# Altium project Low_Level_ECU.PrjPcb (part 2 of 6)

## Sheet 04- Sub Power Supply.SchDoc: Power Supply
size 420 x 297 mm; DocumentNumber: 2; Revision: 1.0; SheetNumber: 4; SheetTotal: 13; Project: LOW LEVEL ECU
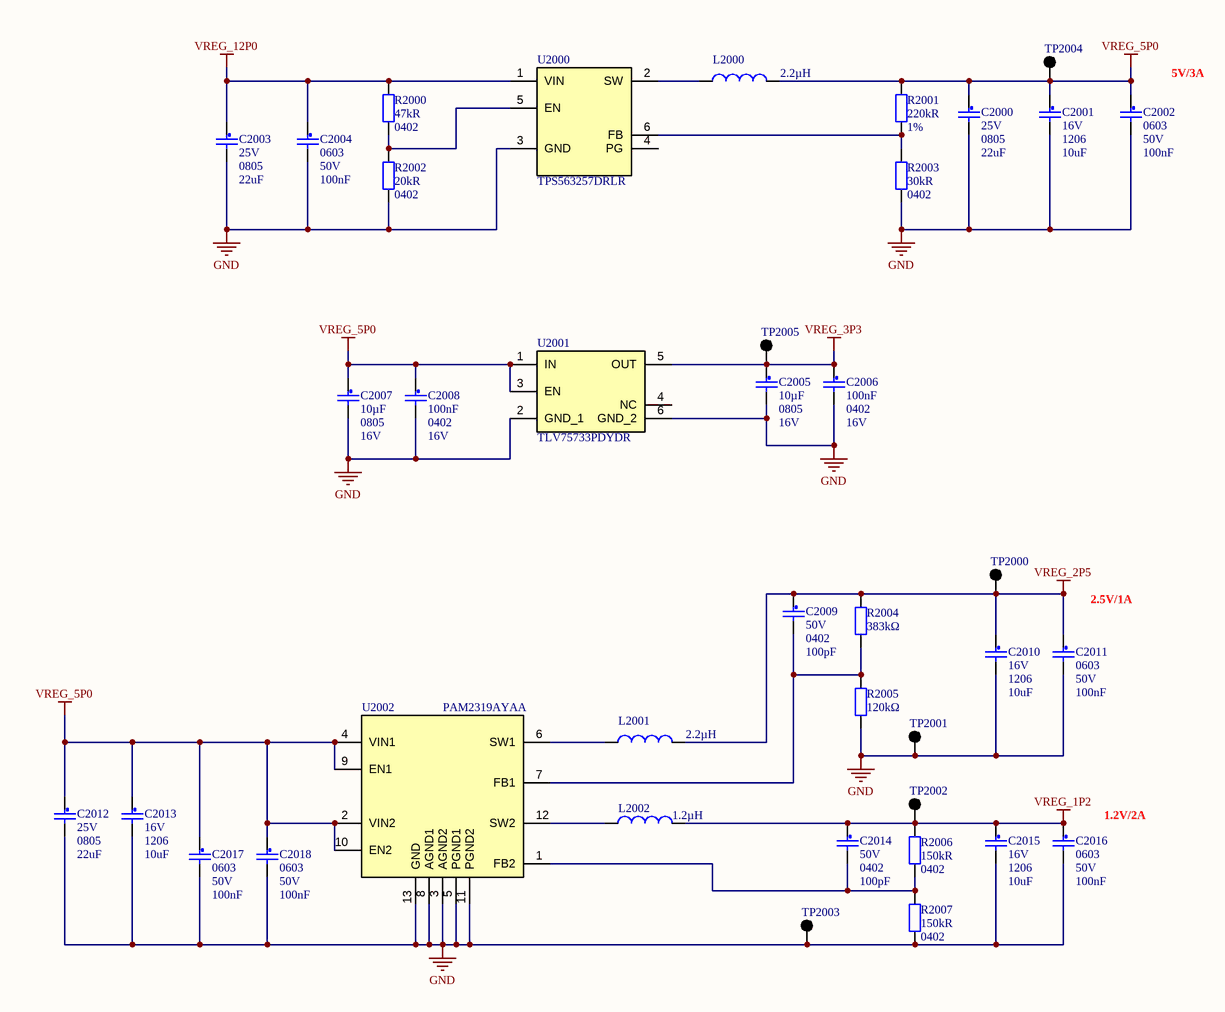
[diagram p2: 04- Sub Power Supply.SchDoc]

### Parts
C2000  Voltage Rating: 25V  Case/Package: 0805  Capacitance: 22uF  [CAP0805]  (hidden comment: GRM21BR61E226ME44K)
C2001  Voltage Rating: 16V  Case/Package: 1206  Capacitance: 10uF  [CAP1206]  (hidden comment: CL31B106KOHVPNE)
C2002  Case/Package: 0603  Voltage Rating: 50V  Capacitance: 100nF  [CAP0603]  (hidden comment: CL10B104KB8WPNC)
C2003  Voltage Rating: 25V  Case/Package: 0805  Capacitance: 22uF  [CAP0805]  (hidden comment: GRM21BR61E226ME44K)
C2004  Case/Package: 0603  Voltage Rating: 50V  Capacitance: 100nF  [CAP0603]  (hidden comment: CL10B104KB8WPNC)
C2005  value 10µF  Case/Package: 0805  Voltage Rating: 16V  [CAP0805]  (hidden comment: GRM21BZ71C106KE15L)
C2006  Capacitance: 100nF  Case/Package: 0402  Voltage Rating (DC): 16V  [CAP0402]  (hidden comment: 0402YC104KAT2A)
C2007  value 10µF  Case/Package: 0805  Voltage Rating: 16V  [CAP0805]  (hidden comment: GRM21BZ71C106KE15L)
C2008  Capacitance: 100nF  Case/Package: 0402  Voltage Rating (DC): 16V  [CAP0402]  (hidden comment: 0402YC104KAT2A)
C2009  Voltage Rating: 50V  Case/Package: 0402  Capacitance: 100pF  [CAP0402]  (hidden comment: GCM1555C1H101JA16D)
C2010  Voltage Rating: 16V  Case/Package: 1206  Capacitance: 10uF  [CAP1206]  (hidden comment: CL31B106KOHVPNE)
C2011  Case/Package: 0603  Voltage Rating: 50V  Capacitance: 100nF  [CAP0603]  (hidden comment: CL10B104KB8WPNC)
C2012  Voltage Rating: 25V  Case/Package: 0805  Capacitance: 22uF  [CAP0805]  (hidden comment: GRM21BR61E226ME44K)
C2013  Voltage Rating: 16V  Case/Package: 1206  Capacitance: 10uF  [CAP1206]  (hidden comment: CL31B106KOHVPNE)
C2014  Voltage Rating: 50V  Case/Package: 0402  Capacitance: 100pF  [CAP0402]  (hidden comment: GCM1555C1H101JA16D)
C2015  Voltage Rating: 16V  Case/Package: 1206  Capacitance: 10uF  [CAP1206]  (hidden comment: CL31B106KOHVPNE)
C2016  Case/Package: 0603  Voltage Rating: 50V  Capacitance: 100nF  [CAP0603]  (hidden comment: CL10B104KB8WPNC)
C2017  Case/Package: 0603  Voltage Rating: 50V  Capacitance: 100nF  [CAP0603]  (hidden comment: CL10B104KB8WPNC)
C2018  Case/Package: 0603  Voltage Rating: 50V  Capacitance: 100nF  [CAP0603]  (hidden comment: CL10B104KB8WPNC)
L2000  value 2.2µH  [INDP414121]  (hidden comment: 74438356022)
L2001  value 2.2µH  [INDP414121]  (hidden comment: 74438356022)
L2002  value 1.2µH  [INDP414121]  (hidden comment: 74438356012)
R2000  Resistance: 47kR  Case/Package: 0402  [RES0402]  (hidden comment: AC0402JR-0747KL)
R2001  value 220kR  Tolerance: 1%  [RES0603]  (hidden comment: RMCF0603FT220K)
R2002  Resistance: 20kR  Case/Package: 0402  [RES0402]  (hidden comment: RC0402FR-0720KL)
R2003  Resistance: 30kR  Case/Package: 0402  [RES0402]  (hidden comment: RMCF0402FT30K0)
R2004  value 383kΩ  [RES0402]  (hidden comment: RC0402FR-07383KL)
R2005  value 120kΩ  [RES0402]  (hidden comment: RT0402FRE07120KL)
R2006  Resistance: 150kR  Case/Package: 0402  [RES0402]  (hidden comment: RC0402FR-07150KL)
R2007  Resistance: 150kR  Case/Package: 0402  [RES0402]  (hidden comment: RC0402FR-07150KL)
TP2000  TP  [TP-SMD-R1]  (value not drawn)  (no BOM)
TP2001  TP  [TP-SMD-R1]  (value not drawn)  (no BOM)
TP2002  TP  [TP-SMD-R1]  (value not drawn)  (no BOM)
TP2003  TP  [TP-SMD-R1]  (value not drawn)  (no BOM)
TP2004  TP  [TP-SMD-R1]  (value not drawn)  (no BOM)
TP2005  TP  [TP-SMD-R1]  (value not drawn)  (no BOM)
U2000  TPS563257DRLR  [SOT-563]
U2001  TLV75733PDYDR  [SOT-23-5 with EPAD]
U2002  PAM2319AYAA  [12-WFDFN_Exposed Pad]

### Nets
GND: C2000.2 C2001.2 C2002.2 C2003.2 C2004.2 C2005.2 C2006.2 C2007.2 C2008.2 C2010.2 C2011.2 C2012.2 C2013.2 C2015.2 C2016.2 C2017.2 C2018.2 R2002.1 R2003.1 R2005.1 R2007.1 TP2001.1 TP2003.1 U2000.3(GND) U2001.2(GND_1) U2001.6(GND_2) U2002.3(AGND2) U2002.5(PGND1) U2002.8(AGND1) U2002.11(PGND2) U2002.13(GND)
VREG_1P2: C2014.1 C2015.1 C2016.1 L2002.2 R2006.2 TP2002.1
VREG_2P5: C2009.1 C2010.1 C2011.1 L2001.2 R2004.2 TP2000.1
VREG_3P3: C2005.1 C2006.1 TP2005.1 U2001.5(OUT)
VREG_5P0: C2000.1 C2001.1 C2002.1 C2007.1 C2008.1 C2012.1 C2013.1 C2017.1 C2018.1 L2000.2 R2001.1 TP2004.1 U2001.1(IN) U2001.3(EN) U2002.2(VIN2) U2002.4(VIN1) U2002.9(EN1) U2002.10(EN2)
VREG_12P0: C2003.1 C2004.1 R2000.2 U2000.1(VIN)
NetC2009_2: C2009.2 R2004.1 R2005.2 U2002.7(FB1)
NetC2014_2: C2014.2 R2006.1 R2007.2 U2002.1(FB2)
NetL2000_1: L2000.1 U2000.2(SW)
NetL2001_1: L2001.1 U2002.6(SW1)
NetL2002_1: L2002.1 U2002.12(SW2)
NetR2000_1: R2000.1 R2002.2 U2000.5(EN)
NetR2001_2: R2001.2 R2003.2 U2000.6(FB)

Not connected (* = marked no-connect by the designer): U2000 4(PG); U2001 4(NC)

### Notes on the sheet
- (near C2002) 5V/3A
- (near C2011) 2.5V/1A
- (near C2016) 1.2V/2A
- TITLE:
- PROJECT:
- Design by:
- Check by:
- Approve by:
- DRAWING NUMBER:
- REVISION:
- SIZE: A3
- SHEET NUMBER
- OFF
- DATE:

### Library data of the parts
C2000 C2003 C2012 = CMP-ROOT-0068-6: CAP CER 22uF 25V 20% X5R 0805 SMD; Manufacturer 1: Murata Electronics; Crossable(YES/NO): YES; Height: 1.25mm; Length: 0.079inch; Max Operating Temperature: 85°C; Tolerance: 20%; Mount Type(SMD/TH): SMD; Manufacturer Part Number 1: GRM21BR61E226ME44K; Weight: 0.000335oz; Dielectric: X5R; Packaging: Tape and Reel; Package Quantity: 10000; Mount: Surface Mount; Termination: SMD/SMT; Composition: Ceramic; Case Code (Imperial): 0805; Thickness: 0.057inch; Voltage Rating (DC): 25V; Case Code (Metric): 2012; Width: 1.25mm; Min Operating Temperature: -55°C; Lead Free: Lead Free
C2001 C2010 C2013 C2015 = CMP-00045-5: CAP CER 10uF 16V 10% X7R 1206 SMD; Manufacturer 1: Samsung; Crossable(YES/NO): YES; Ratings: AEC-Q200; Packaging: Tape and Reel; Thickness: 0.071inch; Min Operating Temperature: -55°C; Case Code (Metric): 3216; Max Operating Temperature: 125°C; Mount: Surface Mount; Length: 0.126inch; Dielectric: X7R; Tolerance: 10%; Width: 0.063inch; Case Code (Imperial): 1206; Manufacturer Part Number 1: CL31B106KOHVPNE; Features: Soft Termination; Mount Type(SMD/TH): SMD; Height: 1.6mm; Lead Free: Lead Free; Voltage Rating (DC): 16V
C2002 C2004 C2011 C2016-C2018 = CMP-00005-5: CAP CER 0.1UF 50V X7R 0603; Manufacturer 1: Samsung; Mount Type(SMD/TH): SMD; Crossable(YES/NO): YES; Tolerance: 10%; Length: 0.063inch; Mount: Surface Mount; Thickness: 0.035inch; Max Operating Temperature: 125°C; Lead Free: Lead Free; Ratings: AEC-Q200; Min Operating Temperature: -55°C; Case Code (Metric): 1608; Features: Soft Termination; Case Code (Imperial): 0603; Width: 0.031inch; Manufacturer Part Number 1: CL10B104KB8WPNC; Packaging: Tape and Reel; Height: 0.8mm; Voltage Rating (DC): 50V
C2005 C2007 = CMP-01170-1: CAP CER 10UF 16V X7R 0805; Manufacturer: Murata; Manufacturer Lifecycle Status: IN PRODUCTION; Dielectric Material: Ceramic; Tolerance: 10%; Length: 2mm; Category: Ceramic Capacitors; Height: 1.25mm; Lifecycle Status: Production; Manufacturer Part Number: GRM21BZ71C106KE15L; Material: Ceramic; Max Operating Temperature: 125°C; Min Operating Temperature: -55°C; Mounting Technology: Surface Mount; Number of Terminals: 2; REACH SVHC: Yes; RoHS: Compliant; Thickness: 1.25mm; Voltage Rating (DC): 16V; Width: 1.25mm
C2006 C2008 = CMP-00988-1: as C1025 on sheet 03- Power Supply; Case Code (Imperial): 0402; Case Code (Metric): 1005; Dielectric: X7R; Manufacturer Part Number 1: 0402YC104KAT2A; Max Operating Temperature: 125°C; Min Operating Temperature: -55°C; Mount: Surface Mount; Voltage Rating: 16V
C2009 C2014 = CMP-00107-4: CAP CER 100pF 50V 5% C0G 0402 SMD; Manufacturer 1: Murata Electronics; Crossable(YES/NO): YES; Depth: 0.5mm; Thickness: 0.022inch; Voltage: 50V; Max Operating Temperature: 125°C; Dielectric: C0G; Radiation Hardening: No; Case Code (Metric): 1005; Weight: 0.000212oz; Manufacturer Part Number 1: GCM1555C1H101JA16D; Package Quantity: 10000; Termination: SMD/SMT; Tolerance: 5%; Voltage Rating (DC): 50V; Mount: Surface Mount; Min Operating Temperature: -55°C; Mount Type(SMD/TH): SMD; Height: 0.5mm; Case Code (Imperial): 0402; Width: 0.02inch; Packaging: Tape and Reel; Lead Free: Lead Free; REACH SVHC: No SVHC; Length: 1mm; Ratings: AEC-Q200
L2000 L2001 = CMP-01184-1: FIXED IND 2.2UH 4.7A 35 MOHM SMD; Manufacturer: Wurth Elektronik; Core Material: Composite, Metal; DC Resistance (DCR): 29mΩ; Inductance Tolerance: 20%; Saturation Current: 6.2A; Self Resonant Frequency: 34MHz; Shielding: Shielded; Test Frequency: 100kHz; Case/Package: SMD/SMT; Ambient Temperature Range High: 85°C; Ambient Temperature Range Low: -40°C; Category: Fixed Inductors; Current Rating: 4.7A; Height: 2mm; Height - Seated (Max): 2.1082mm; Length: 4mm; Manufacturer Part Number: 74438356022; Max Operating Temperature: 125°C; Min Operating Temperature: -40°C; Mounting Technology: Surface Mount; Pins: 2; REACH SVHC: Unknown; RMS Current (Irms): 4.7A; RoHS: Compliant; Tolerance: 20%; Width: 4mm
L2002 = CMP-01185-1: FIXED IND 1.2UH 5.8A 18 MOHM SMD; Manufacturer: Wurth Elektronik; Core Material: Composite, Metal; DC Resistance (DCR): 15mΩ; Inductance Tolerance: 20%; Saturation Current: 9A; Self Resonant Frequency: 52MHz; ESR: 18mΩ; Shielding: Shielded; Test Frequency: 100kHz; Ambient Temperature Range High: 85°C; Ambient Temperature Range Low: -40°C; Case/Package: SMD/SMT; Category: Fixed Inductors; Current Rating: 5.8A; Height: 2mm; Height - Seated (Max): 2.1082mm; Length: 4mm; Manufacturer Part Number: 74438356012; Max Operating Temperature: 125°C; Min Operating Temperature: -40°C; Mounting Technology: Surface Mount; Pins: 2; REACH SVHC: Unknown; RMS Current (Irms): 5.8A; RoHS: Compliant; Tolerance: 20%; Width: 4mm
R2000 = CMP-00109-2: RES SMD 47K OHM 5% 1/16W 0402; Manufacturer 1: Yageo; Power Rating: 62.5mW; Voltage Rating: 50V; Max Power Dissipation: 63mW; Temperature Coefficient: 100ppm/°C; Crossable(YES/NO): YES; Height: 0.015inch; Mount Type(SMD/TH): SMD; Features: Moisture Resistant,Automotive AEC-Q200; Min Operating Temperature: -55°C; Number of Terminations: 2; Case Code (Metric): 1005; Packaging: Tape and Reel; Width: 0.02inch; Manufacturer Part Number 1: AC0402JR-0747KL; Tolerance: 5%; Termination: SMD/SMT; Lead Free: Lead Free; Case Code (Imperial): 0402; Length: 0.039inch; Composition: Thick Film; Max Operating Temperature: 155°C
R2001 = CMP-01087-1: RES 220K OHM 1% 1/10W 0603; Manufacturer: Stackpole Electronics; Package Width: 0.8mm; Package Height: 0.45mm; Package Length: 1.55mm; Power: 100mW; Rated Temperature: 70°C; Reference Standard: AEC-Q200; Temperature Coefficient (ppm/Cel): 100; Working Voltage: 75V; Category: Chip SMD Resistors; Construction: Rectangular; JESD-609 Code: e3; Manufacturer Part Number: RMCF0603FT220K; Max Operating Temperature: 155°C; Min Operating Temperature: -55°C; Mounting Technology: Surface Mount; Pins: 2; Package Shape: Rectangular; Packaging: Tape and Reel; Reach SVHC Compliant: Yes; Resistor Type: FIXED RESISTOR; RoHS Compliant: Yes; Case/Package: 0603; Technology: METAL GLAZE/THICK FILM; Terminal Finish: Nickel; Termination: Wraparound
R2002 = CMP-00464-1: RES SMD 20K OHM 1% 1/16W 0402; Manufacturer 1: Yageo; Power Rating: 62.5mW; Crossable(YES/NO): YES; Max Power Dissipation: 63mW; Temperature Coefficient: 100ppm/°C; Voltage Rating: 50V; REACH SVHC: No SVHC; Length: 1mm; Termination: SMD/SMT; Mount Type(SMD/TH): SMD; Number of Pins: 2; Lead Free: Lead Free; Number of Terminations: 2; Width: 0.02inch; Composition: Thick Film; Manufacturer Part Number 1: RC0402FR-0720KL; Features: Moisture Resistant; Min Operating Temperature: -55°C; Max Operating Temperature: 155°C; Packaging: Tape and Reel; Depth: 0.5mm; Case Code (Imperial): 0402; Height: 0.016inch; Voltage Rating (DC): 50V; Case Code (Metric): 1005; Military Standard: Not; Package Quantity: 1; Tolerance: 1%
R2003 = CMP-00355-2: RES 30kR 1/16W 1% 0402 SMD; Manufacturer 1: Stackpole Electronics Inc; Max Power Dissipation: 63mW; Crossable(YES/NO): YES; Temperature Coefficient: 100ppm/°C; Case Code (Metric): 1005; Case Code (Imperial): 0402; Tolerance: 1%; Contact Plating: Tin,Matte; Features: Automotive AEC-Q200; Number of Terminations: 2; Length: 0.039inch; Packaging: Tape and Reel; Max Operating Temperature: 155°C; Mount Type(SMD/TH): SMD; Min Operating Temperature: -55°C; Mount: Surface Mount; Height: 0.016inch; Radiation Hardening: No; Composition: Thick Film; Manufacturer Part Number 1: RMCF0402FT30K0; Width: 0.02inch; Package Quantity: 10000
R2004 = CMP-01187-1: RES 383K OHM 1% 1/16W 0402; Manufacturer: Yageo Group; Max Power Dissipation: 63mW; Power Dissipation: 62.5mW; Temperature Coefficient: 100ppm/°C; Voltage Rating: 50V; China RoHS: Non-Compliant; Case Code (Imperial): 0402; Case Code (Metric): 1005; Case/Package: 0402; Category: Chip SMD Resistors; Composition: Thick Film; Contact Plating: Tin; Depth: 500µm; Features: Moisture Resistant; Height: 350µm; Lead Free: Lead Free; Length: 1mm; Lifecycle Status: Production; Manufacturer Part Number: RC0402FR-07383KL; Max Operating Temperature: 155°C; Military Standard: Not; Min Operating Temperature: -55°C; Mounting Technology: Surface Mount; Number of Terminals: 2; Number of Terminations: 2; Power Rating: 63mW; Radiation Hardening: No; REACH SVHC: Yes; RoHS: Compliant; Schedule B: 8533210045, 8533210045|8533210045|8533210045|8533210045|8533210045; Termination: SMD/SMT; Tolerance: 1%; Voltage Rating (DC): 50V; Width: 500µm; Working Voltage: 50V
R2005 = CMP-01186-1: RES SMD 120K OHM 1% 1/16W 0402; Manufacturer: Yageo Group; Power Dissipation: 62.5mW; Power Rating: 63mW; Temperature Coefficient: 50ppm/°C; Voltage Rating: 50V; China RoHS: Non-Compliant; Case Code (Metric): 0402; Case/Package: 0402; Category: Chip SMD Resistors; Composition: Thin Film; Contact Plating: Tin; Depth: 500µm; Height: 300µm; Lead Free: Lead Free; Length: 1mm; Lifecycle Status: Production; Manufacturer Part Number: RT0402FRE07120KL; Max Operating Temperature: 155°C; Military Standard: Not; Min Operating Temperature: -55°C; Mounting Technology: Surface Mount; Number of Terminals: 2; Radiation Hardening: No; REACH SVHC: Yes; RoHS: Compliant; Tolerance: 1%; Voltage Rating (DC): 50V; Width: 500µm; Working Voltage: 50V
R2006 R2007 = CMP-00368-1: RES SMD 150K OHM 1% 1/16W 0402; Manufacturer 1: Yageo; Voltage Rating (DC): 50V; Power Rating: 62.5mW; Crossable(YES/NO): YES; Temperature Coefficient: 100ppm/°C; Max Power Dissipation: 63mW; Tolerance: 1%; Termination: SMD/SMT; Number of Pins: 2; Features: Moisture Resistant; Min Operating Temperature: -55°C; REACH SVHC: No SVHC; Military Standard: Not; Packaging: Tape and Reel; Composition: Thick Film; Mount Type(SMD/TH): SMD; Package Quantity: 1; Height: 0.016inch; Case Code (Imperial): 0402; Manufacturer Part Number 1: RC0402FR-07150KL; Depth: 0.5mm; Lead Free: Lead Free; Case Code (Metric): 1005; Width: 0.5mm; Voltage Rating: 50V; Working Voltage: 50V; Length: 1mm; Max Operating Temperature: 155°C; Number of Terminations: 2
TP2000-TP2005 = CMP-ROOT-0080-12: Test Point 1x1mm; Manufacturer Part Number 1: NA; Mount Type(SMD/TH): TH; Crossable(YES/NO): YES; Manufacturer 1: N/A
U2000 = CMP-01183-1: IC REG BUCK ADJ 3A SOT563; Manufacturer: Texas Instruments; Manufacturer Lifecycle Status: ACTIVE; Category: Voltage Regulators - Switching; Height: 600µm; Length: 1.6mm; Lifecycle Status: Production; Manufacturer Part Number: TPS563257DRLR; Pins: 6; RoHS: Compliant; Thickness: 550µm; Topology: Buck; Width: 1.2mm
U2001 = CMP-01189-1: IC REG LINEAR 3.3V 1A SOT23-5; Manufacturer: Texas Instruments; Manufacturer Lifecycle Status: ACTIVE; Dropout Voltage: 1.35V; Accuracy: 1%; Max Junction Temperature (Tj): 125°C; Max Supply Voltage: 5.5V; Min Supply Voltage: 1.45V; Number of Outputs: 1; Case/Package: SOT-23; Category: LDO Voltage Regulators; Height: 1.45mm; Length: 2.9mm; Lifecycle Status: Production; Manufacturer Part Number: TLV75733PDYDR; Max Operating Temperature: 125°C; Min Operating Temperature: -40°C; Pins: 5; Output Current: 1A; Output Voltage: 3.3V; RoHS: Compliant; Schedule B: 8542390000, 8542390000|8542390000|8542390000|8542390000|8542390000; Thickness: 1.2mm; Width: 1.6mm
U2002 = CMP-01159-1: IC REG BUCK ADJ 1A/2A DL 12WDFN; Manufacturer: Diodes Inc.; Efficiency: 87%; Max Supply Voltage: 5.5V; Max Output current: 2A; Max Output Voltage: 3.3V; Min Input Voltage: 2.7V; Min Output Voltage: 1V; Number of Outputs: 2; Output Configuration: Positive; Output Type: Adjustable; Switching Frequency: 2.5MHz; Synchronous Rectifier: Yes; Category: Voltage Regulators - Switching; China RoHS: Compliant; Color: Black; Diameter: 20.193mm; Height: 14.986mm; Lead Free: Lead Free; Lifecycle Status: Production; Manufacturer Part Number: PAM2319AYAA; Material: Plastic; Max Operating Temperature: 85°C; Min Operating Temperature: -40°C; Mounting Technology: Surface Mount; Pins: 12; Operating Supply Voltage: 5.5V; Output Current: 2A; Output Voltage: 3.3V; Packaging: Tape & Reel; Radiation Hardening: No; REACH SVHC: Yes; RoHS: Compliant; Schedule B: 8542390000, 8542390000|8542390000|8542390000|8542390000|8542390000

## Sheet 05- MCU POWER.SchDoc: MCU1
size 420 x 297 mm; Revision: 1.0; SheetNumber: 5; SheetTotal: 13; Project: LOW LEVEL ECU
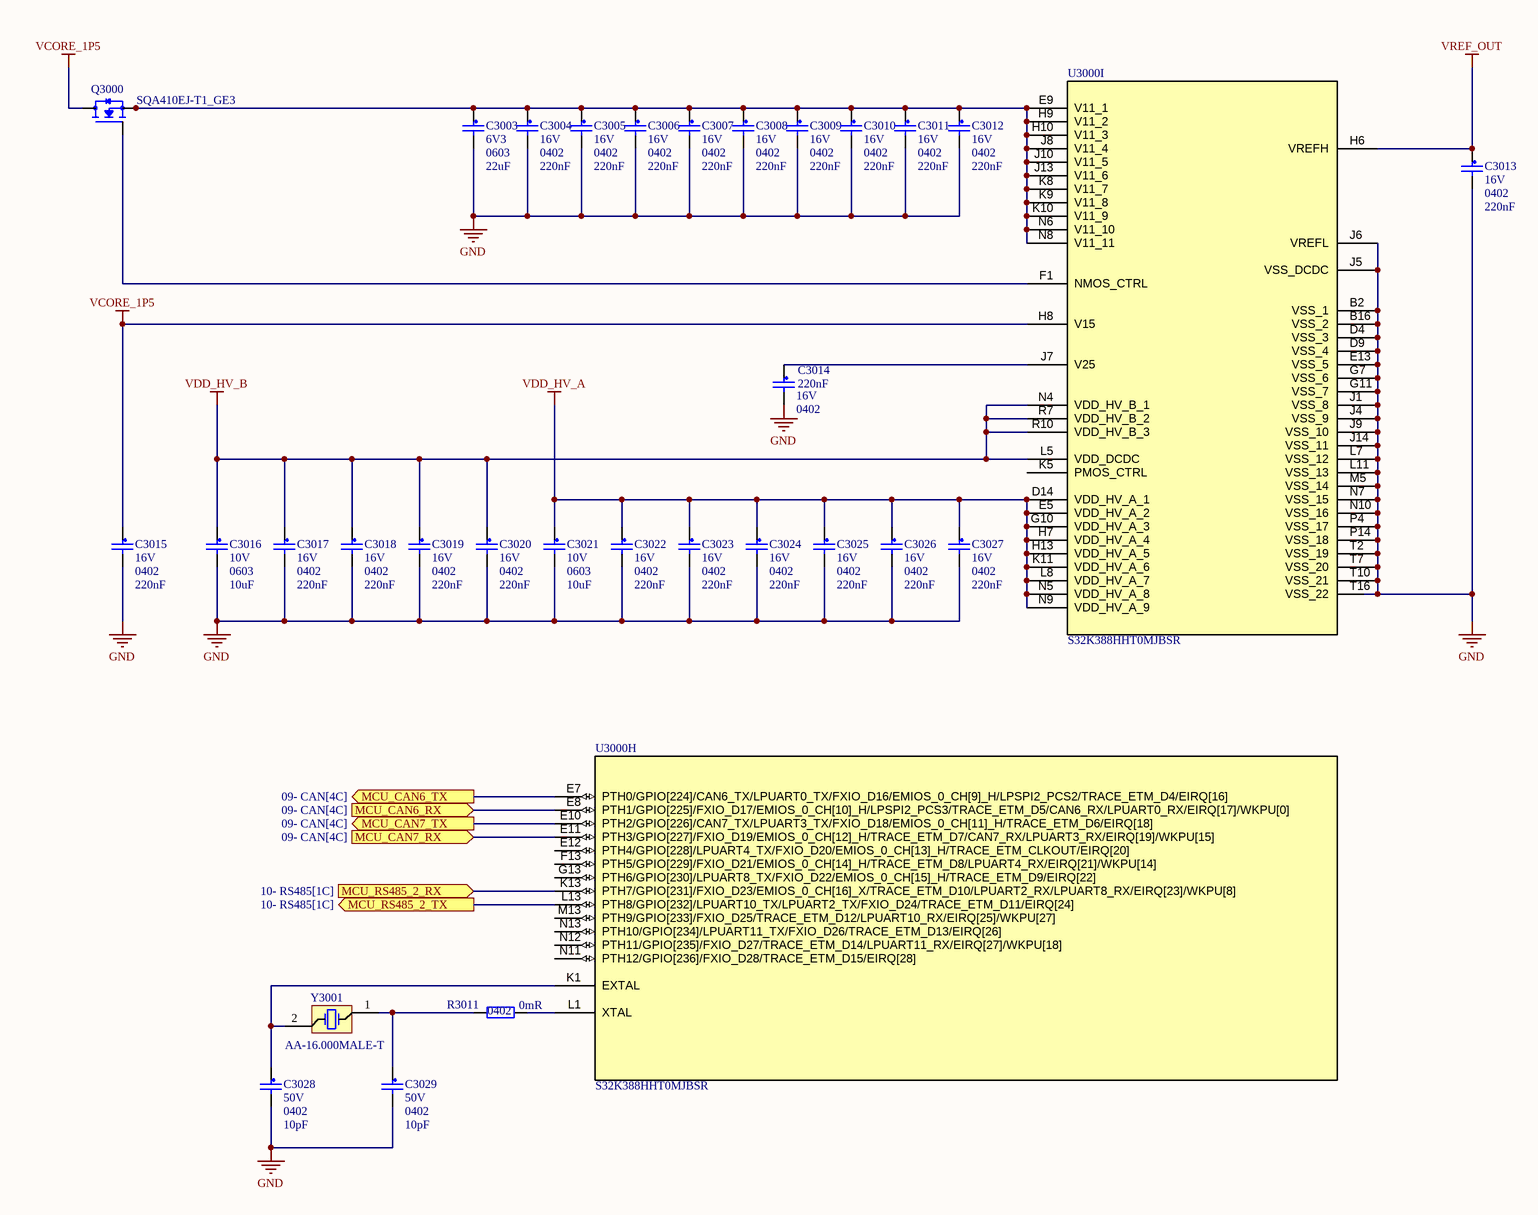
[diagram p3: 05- MCU POWER.SchDoc]

### Parts
C3003  Voltage Rating: 6V3  Case/Package: 0603  Capacitance: 22uF  [CAP0603]  (hidden comment: GRT188C80J226ME13D)
C3004  Voltage Rating: 16V  Case/Package: 0402  Capacitance: 220nF  [CAP0402]  (hidden comment: GCM155R71C224KE02D)
C3005  Voltage Rating: 16V  Case/Package: 0402  Capacitance: 220nF  [CAP0402]  (hidden comment: GCM155R71C224KE02D)
C3006  Voltage Rating: 16V  Case/Package: 0402  Capacitance: 220nF  [CAP0402]  (hidden comment: GCM155R71C224KE02D)
C3007  Voltage Rating: 16V  Case/Package: 0402  Capacitance: 220nF  [CAP0402]  (hidden comment: GCM155R71C224KE02D)
C3008  Voltage Rating: 16V  Case/Package: 0402  Capacitance: 220nF  [CAP0402]  (hidden comment: GCM155R71C224KE02D)
C3009  Voltage Rating: 16V  Case/Package: 0402  Capacitance: 220nF  [CAP0402]  (hidden comment: GCM155R71C224KE02D)
C3010  Voltage Rating: 16V  Case/Package: 0402  Capacitance: 220nF  [CAP0402]  (hidden comment: GCM155R71C224KE02D)
C3011  Voltage Rating: 16V  Case/Package: 0402  Capacitance: 220nF  [CAP0402]  (hidden comment: GCM155R71C224KE02D)
C3012  Voltage Rating: 16V  Case/Package: 0402  Capacitance: 220nF  [CAP0402]  (hidden comment: GCM155R71C224KE02D)
C3013  Voltage Rating: 16V  Case/Package: 0402  Capacitance: 220nF  [CAP0402]  (hidden comment: GCM155R71C224KE02D)
C3014  Voltage Rating: 16V  Case/Package: 0402  Capacitance: 220nF  [CAP0402]  (hidden comment: GCM155R71C224KE02D)
C3015  Voltage Rating: 16V  Case/Package: 0402  Capacitance: 220nF  [CAP0402]  (hidden comment: GCM155R71C224KE02D)
C3016  Voltage Rating: 10V  Case/Package: 0603  Capacitance: 10uF  [CAP0603]  (hidden comment: CL10A106MP8NNNC)
C3017  Voltage Rating: 16V  Case/Package: 0402  Capacitance: 220nF  [CAP0402]  (hidden comment: GCM155R71C224KE02D)
C3018  Voltage Rating: 16V  Case/Package: 0402  Capacitance: 220nF  [CAP0402]  (hidden comment: GCM155R71C224KE02D)
C3019  Voltage Rating: 16V  Case/Package: 0402  Capacitance: 220nF  [CAP0402]  (hidden comment: GCM155R71C224KE02D)
C3020  Voltage Rating: 16V  Case/Package: 0402  Capacitance: 220nF  [CAP0402]  (hidden comment: GCM155R71C224KE02D)
C3021  Voltage Rating: 10V  Case/Package: 0603  Capacitance: 10uF  [CAP0603]  (hidden comment: CL10A106MP8NNNC)
C3022  Voltage Rating: 16V  Case/Package: 0402  Capacitance: 220nF  [CAP0402]  (hidden comment: GCM155R71C224KE02D)
C3023  Voltage Rating: 16V  Case/Package: 0402  Capacitance: 220nF  [CAP0402]  (hidden comment: GCM155R71C224KE02D)
C3024  Voltage Rating: 16V  Case/Package: 0402  Capacitance: 220nF  [CAP0402]  (hidden comment: GCM155R71C224KE02D)
C3025  Voltage Rating: 16V  Case/Package: 0402  Capacitance: 220nF  [CAP0402]  (hidden comment: GCM155R71C224KE02D)
C3026  Voltage Rating: 16V  Case/Package: 0402  Capacitance: 220nF  [CAP0402]  (hidden comment: GCM155R71C224KE02D)
C3027  Voltage Rating: 16V  Case/Package: 0402  Capacitance: 220nF  [CAP0402]  (hidden comment: GCM155R71C224KE02D)
C3028  Voltage Rating: 50V  Case/Package: 0402  Capacitance: 10pF  [CAP0402]  (hidden comment: GCM1555C1H100JA16D)
C3029  Voltage Rating: 50V  Case/Package: 0402  Capacitance: 10pF  [CAP0402]  (hidden comment: GCM1555C1H100JA16D)
Q3000  SQA410EJ-T1_GE3  [PowerPAK® SC-70-6]
R3011  Resistance: 0mR  Case/Package: 0402  [RES0402]  (hidden comment: RMCF0402ZT0R00)
U3000  S32K388HHT0MJBSR  [BGA289C80P17X17_1400X1400X152]  (parts H,I of 9)
Y3001  AA-16.000MALE-T  [CRYSTAL5032]

### Ports
MCU_CAN6_RX (in, see 09- CAN[4C]), MCU_CAN6_TX (out, see 09- CAN[4C]), MCU_CAN7_RX (in, see 09- CAN[4C]), MCU_CAN7_TX (out, see 09- CAN[4C]), MCU_RS485_2_RX (in, see 10- RS485[1C]), MCU_RS485_2_TX (out, see 10- RS485[1C])

### Nets
GND: C3003.2 C3004.2 C3005.2 C3006.2 C3007.2 C3008.2 C3009.2 C3010.2 C3011.2 C3012.2 C3013.2 C3014.2 C3015.2 C3016.2 C3017.2 C3018.2 C3019.2 C3020.2 C3021.2 C3022.2 C3023.2 C3024.2 C3025.2 C3026.2 C3027.2 C3028.2 C3029.2 U3000.B2(VSS_1) U3000.B16(VSS_2) U3000.D4(VSS_3) U3000.D9(VSS_4) U3000.E13(VSS_5) U3000.G7(VSS_6) U3000.G11(VSS_7) U3000.J1(VSS_8) U3000.J4(VSS_9) U3000.J5(VSS_DCDC) U3000.J6(VREFL) U3000.J9(VSS_10) U3000.J14(VSS_11) U3000.L7(VSS_12) U3000.L11(VSS_13) U3000.M5(VSS_14) U3000.N7(VSS_15) U3000.N10(VSS_16) U3000.P4(VSS_17) U3000.P14(VSS_18) U3000.T2(VSS_19) U3000.T7(VSS_20) U3000.T10(VSS_21) U3000.T16(VSS_22)
VCORE_1P5: C3015.1 Q3000.1_2_5_6(D) U3000.H8(V15)
VDD_HV_A: C3021.1 C3022.1 C3023.1 C3024.1 C3025.1 C3026.1 C3027.1 U3000.D14(VDD_HV_A_1) U3000.E5(VDD_HV_A_2) U3000.G10(VDD_HV_A_3) U3000.H7(VDD_HV_A_4) U3000.H13(VDD_HV_A_5) U3000.K11(VDD_HV_A_6) U3000.L8(VDD_HV_A_7) U3000.N5(VDD_HV_A_8) U3000.N9(VDD_HV_A_9)
VDD_HV_B: C3016.1 C3017.1 C3018.1 C3019.1 C3020.1 U3000.L5(VDD_DCDC) U3000.N4(VDD_HV_B_1) U3000.R7(VDD_HV_B_2) U3000.R10(VDD_HV_B_3)
VREF_OUT: C3013.1 U3000.H6(VREFH)
NetC3003_1: C3003.1 C3004.1 C3005.1 C3006.1 C3007.1 C3008.1 C3009.1 C3010.1 C3011.1 C3012.1 Q3000.4(S) Q3000.7(S) U3000.E9(V11_1) U3000.H9(V11_2) U3000.H10(V11_3) U3000.J8(V11_4) U3000.J10(V11_5) U3000.J13(V11_6) U3000.K8(V11_7) U3000.K9(V11_8) U3000.K10(V11_9) U3000.N6(V11_10) U3000.N8(V11_11)
NetC3014_1: C3014.1 U3000.J7(V25)
NetC3028_1: C3028.1 U3000.K1(EXTAL) Y3001.2(OSC2)
NetC3029_1: C3029.1 R3011.1 Y3001.1(OSC1)
NetQ3000_3: Q3000.3(G) U3000.F1(NMOS_CTRL)
NetR3011_2: R3011.2 U3000.L1(XTAL)
NetU3000_E7: U3000.E7(PTH0/GPIO[224]/CAN6_TX/LPUART0_TX/FXIO_D16/EMIOS_0_CH[9]_H/LPSPI2_PCS2/TRACE_ETM_D4/EIRQ[16]) ; port MCU_CAN6_TX
NetU3000_E8: U3000.E8(PTH1/GPIO[225]/FXIO_D17/EMIOS_0_CH[10]_H/LPSPI2_PCS3/TRACE_ETM_D5/CAN6_RX/LPUART0_RX/EIRQ[17]/WKPU[0]) ; port MCU_CAN6_RX
NetU3000_E10: U3000.E10(PTH2/GPIO[226]/CAN7_TX/LPUART3_TX/FXIO_D18/EMIOS_0_CH[11]_H/TRACE_ETM_D6/EIRQ[18]) ; port MCU_CAN7_TX
NetU3000_E11: U3000.E11(PTH3/GPIO[227]/FXIO_D19/EMIOS_0_CH[12]_H/TRACE_ETM_D7/CAN7_RX/LPUART3_RX/EIRQ[19]/WKPU[15]) ; port MCU_CAN7_RX
NetU3000_K13: U3000.K13(PTH7/GPIO[231]/FXIO_D23/EMIOS_0_CH[16]_X/TRACE_ETM_D10/LPUART2_RX/LPUART8_RX/EIRQ[23]/WKPU[8]) ; port MCU_RS485_2_RX
NetU3000_L13: U3000.L13(PTH8/GPIO[232]/LPUART10_TX/LPUART2_TX/FXIO_D24/TRACE_ETM_D11/EIRQ[24]) ; port MCU_RS485_2_TX

Not connected (* = marked no-connect by the designer): U3000 E12(PTH4/GPIO[228]/LPUART4_TX/FXIO_D20/EMIOS_0_CH[13]_H/TRACE_ETM_CLKOUT/EIRQ[20]) F13(PTH5/GPIO[229]/FXIO_D21/EMIOS_0_CH[14]_H/TRACE_ETM_D8/LPUART4_RX/EIRQ[21]/WKPU[14]) G13(PTH6/GPIO[230]/LPUART8_TX/FXIO_D22/EMIOS_0_CH[15]_H/TRACE_ETM_D9/EIRQ[22]) K5(PMOS_CTRL) M13(PTH9/GPIO[233]/FXIO_D25/TRACE_ETM_D12/LPUART10_RX/EIRQ[25]/WKPU[27]) N11(PTH12/GPIO[236]/FXIO_D28/TRACE_ETM_D15/EIRQ[28]) N12(PTH11/GPIO[235]/FXIO_D27/TRACE_ETM_D14/LPUART11_RX/EIRQ[27]/WKPU[18]) N13(PTH10/GPIO[234]/LPUART11_TX/FXIO_D26/TRACE_ETM_D13/EIRQ[26])

### Notes on the sheet
- TITLE:
- PROJECT:
- Design by:
- Check by:
- Approve by:
- DRAWING NUMBER:
- REVISION:
- SIZE: A3
- SHEET NUMBER
- OFF
- DATE:

### Library data of the parts
C3003 = CMP-00267-6: CAP CER 22uF 6V3 20% X6S 0603 SMD; Manufacturer 1: Murata Electronics; Crossable(YES/NO): YES; Mount Type(SMD/TH): SMD; Min Operating Temperature: -55°C; Max Operating Temperature: 105°C; Manufacturer Part Number 1: GRT188C80J226ME13D; Height: 0.8mm; Lead Free: Lead Free; Mount: Surface Mount; Voltage Rating (DC): 6V3
C3004-C3015 C3017-C3020 C3022-C3027 = CMP-00362-1: CAP CER 0.22UF 16V X7R 0402; Manufacturer 1: Murata Electronics; Mount Type(SMD/TH): SMD; Crossable(YES/NO): YES; Tolerance: 10%; Weight: 0.000212oz; Min Operating Temperature: -55°C; Packaging: Tape and Reel; Width: 0.5mm; Manufacturer Part Number 1: GCM155R71C224KE02D; Thickness: 0.022inch; Voltage Rating (DC): 16V; Package Quantity: 10000; Height: 0.5mm; Case Code (Imperial): 0402; Lead Free: Lead Free; Length: 0.039inch; Mount: Surface Mount; Termination: SMD/SMT; Dielectric: X7R; Ratings: AEC-Q200; Max Operating Temperature: 125°C; Case Code (Metric): 1005
C3016 C3021 = CMP-ROOT-0115-5: CAP CER 10uF 10V X5R 0603; Manufacturer 1: Samsung; Tolerance: 20%; Crossable(YES/NO): YES; Mount Type(SMD/TH): SMD; Max Operating Temperature: 85°C; Mount: Surface Mount; Thickness: 0.035inch; Radiation Hardening: No; Width: 0.031inch; Manufacturer Part Number 1: CL10A106MP8NNNC; Case Code (Imperial): 0603; Package Quantity: 1; Min Operating Temperature: -55°C; Voltage Rating (DC): 10V; Depth: 0.8mm; Dielectric: X5R; Packaging: Tape and Reel; Contact Plating: Tin; Height: 0.8mm; Length: 1.6mm; Lead Free: Lead Free; Case Code (Metric): 1608
C3028 C3029 = CMP-00258-4: CAP CER 10pF 50V 5% C0G 0402 SMD; Manufacturer 1: Murata Electronics; Crossable(YES/NO): YES; Weight: 0.000212oz; Case Code (Metric): 1005; Mount: Surface Mount; Tolerance: 5%; Lead Free: Lead Free; Width: 0.02inch; Packaging: Tape and Reel; Height: 0.5mm; Length: 0.039inch; Min Operating Temperature: -55°C; Thickness: 0.022inch; Voltage Rating (DC): 50V; Package Quantity: 10000; Manufacturer Part Number 1: GCM1555C1H100JA16D; Case Code (Imperial): 0402; Ratings: AEC-Q200; Mount Type(SMD/TH): SMD; Dielectric: C0G; Max Operating Temperature: 125°C; REACH SVHC: No SVHC; Termination: SMD/SMT
Q3000 = CMP-01172-1: MOSFET N-CH 20V 7.8A PPAK SC70-6; Manufacturer: Vishay; Manufacturer Package Identifier: C-07431-SINGLE; Manufacturer Part Number: SQA410EJ-T1-GE3; Element Configuration: Single; Drain to Source Resistance: 23mΩ; Fall Time: 8ns; Gate to Source Voltage (Vgs): 8V; Input Capacitance: 485pF; Max Junction Temperature (Tj): 175°C; Max Power Dissipation: 13.6W; Number of Channels: 1; Rds On Max: 28mΩ; Threshold Voltage: 600mV; Turn-Off Delay Time: 21ns; Category: MOSFETs; Continuous Drain Current (ID): 7.8A; Drain to Source Breakdown Voltage: 20V; Drain to Source Voltage (Vdss): 20V; Height: 800µm; Max Operating Temperature: 175°C; Min Operating Temperature: -55°C; Mounting Technology: Surface Mount; Number of Elements: 1; Pins: 6; Packaging: Tape & Reel (TR); Power Dissipation: 13.6W; Radiation Hardening: No; REACH SVHC: Unknown; Rise Time: 8ns; RoHS: Compliant; Schedule B: 8541290080; Turn-On Delay Time: 8ns
R3011 = CMP-ROOT-0037-10: RES 0R 1/16W 1% 0402 SMD; Manufacturer 1: Stackpole Electronics Inc; Max Power Dissipation: 63mW; Crossable(YES/NO): YES; Current Rating: 1A; Working Voltage: 50V; Height: 0.016inch; Radiation Hardening: No; Max Operating Temperature: 155°C; Min Operating Temperature: -55°C; Lead Free: Lead Free; Contact Plating: Tin,Matte; Number of Terminations: 2; Features: Automotive AEC-Q200; Case Code (Metric): 1005; Mount: Surface Mount; Packaging: Tape and Reel; Width: 0.02inch; Mount Type(SMD/TH): SMD; Length: 0.039inch; Depth: 0.5mm; Composition: Thick Film; Power Rating: 63mW; Military Standard: Not; Case Code (Imperial): 0402; Manufacturer Part Number 1: RMCF0402ZT0R00
U3000 = CMP-01150-1: ARM® Cortex®-M7F S32K3 Microcontroller IC 32-Bit 5-Core 320MHz 8MB (8M x 8) FLASH 289-LFBGA (14x14); Manufacturer: NXP Semiconductors; Category: Microcontrollers; Manufacturer Part Number: S32K388HHT0MJBSR
Y3001 = CMP-01173-1: CRYSTAL 16.0000MHZ 12PF SMD; Manufacturer: TXC; ESR (Equivalent Series Resistance): 100Ω; Frequency: 16MHz; Frequency Stability: 150ppm; Frequency Tolerance: 0.003%; Case/Package: SMD/SMT; Category: Crystals; Height: 1.3462mm; Length: 5.0038mm; Lifecycle Status: Production; Load Capacitance: 12pF; Manufacturer Part Number: AA-16.000MALE-T; Max Operating Temperature: 125°C; Min Operating Temperature: -40°C; Mounting Technology: Surface Mount; Pins: 2; Packaging: Tape & Reel; Ratings: AEC-Q200; REACH SVHC: No; RoHS: Compliant; Schedule B: 8541600080, 8541600080|8541600080|8541600080|8541600080|8541600080|8541600080|8541600080|8541600080|8541600080|8541600080|8541600080|8541600080|8541600080|8541600080|8541600080|8541600080|8541600080|8541600080|8541600080|8541600080|8541600080|8541600080|8541600080|85; Termination: SMD/SMT; Tolerance: 0.003%; Width: 3.2mm

## Sheet 06- MCU PORTA_B.SchDoc: MCU2
size 420 x 297 mm; Revision: 1.0; SheetNumber: 6; SheetTotal: 13; Project: LOW LEVEL ECU
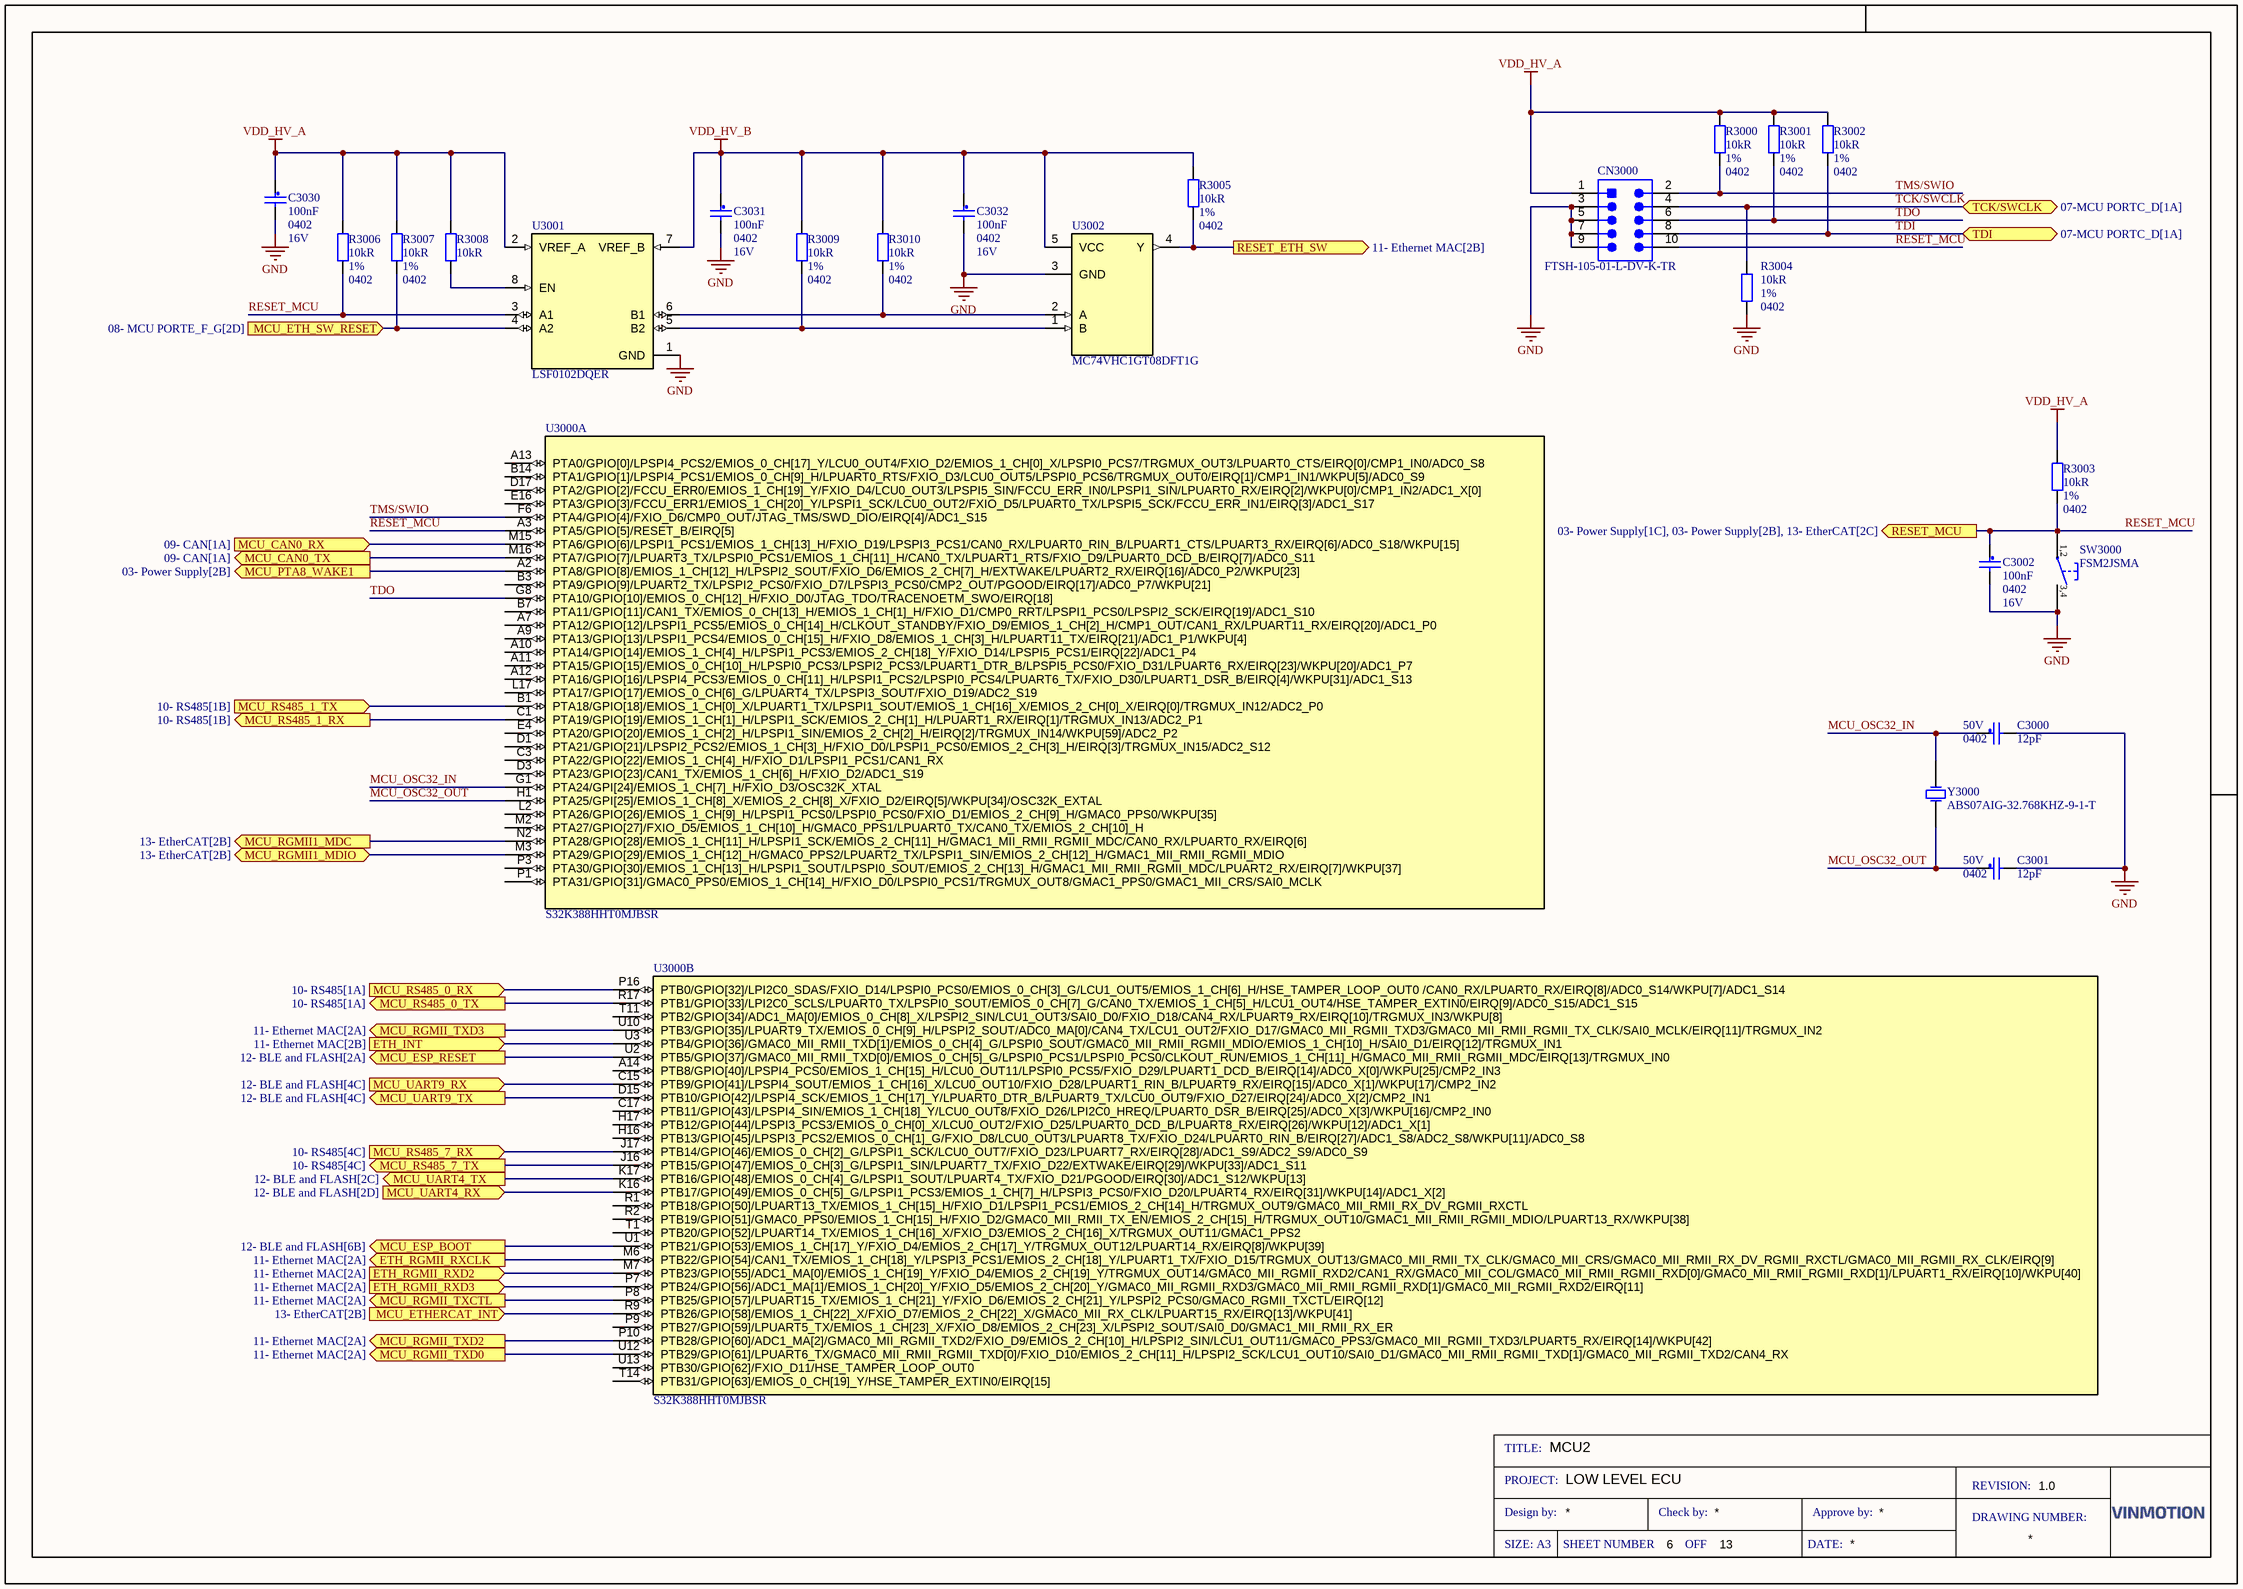
[diagram p4: 06- MCU PORTA_B.SchDoc]

### Parts
C3000  Voltage Rating: 50V  Case/Package: 0402  Capacitance: 12pF  [CAP0402]  (hidden comment: GCM1555C1H120JA16D)
C3001  Voltage Rating: 50V  Case/Package: 0402  Capacitance: 12pF  [CAP0402]  (hidden comment: GCM1555C1H120JA16D)
C3002  Capacitance: 100nF  Case/Package: 0402  Voltage Rating (DC): 16V  [CAP0402]  (hidden comment: 0402YC104KAT2A)
C3030  Capacitance: 100nF  Case/Package: 0402  Voltage Rating (DC): 16V  [CAP0402]  (hidden comment: 0402YC104KAT2A)
C3031  Capacitance: 100nF  Case/Package: 0402  Voltage Rating (DC): 16V  [CAP0402]  (hidden comment: 0402YC104KAT2A)
C3032  Capacitance: 100nF  Case/Package: 0402  Voltage Rating (DC): 16V  [CAP0402]  (hidden comment: 0402YC104KAT2A)
CN3000  FTSH-105-01-L-DV-K-TR  [SMTC-FTSH-105-01-L-DV-K_R]
R3000  value 10kR  Tolerance: 1%  Case/Package: 0402  [RES0402]  (hidden comment: RMCF0402FT10K0)
R3001  value 10kR  Tolerance: 1%  Case/Package: 0402  [RES0402]  (hidden comment: RMCF0402FT10K0)
R3002  value 10kR  Tolerance: 1%  Case/Package: 0402  [RES0402]  (hidden comment: RMCF0402FT10K0)
R3003  value 10kR  Tolerance: 1%  Case/Package: 0402  [RES0402]  (hidden comment: RMCF0402FT10K0)
R3004  value 10kR  Tolerance: 1%  Case/Package: 0402  [RES0402]  (hidden comment: RMCF0402FT10K0)
R3005  value 10kR  Tolerance: 1%  Case/Package: 0402  [RES0402]  (hidden comment: RMCF0402FT10K0)
R3006  value 10kR  Tolerance: 1%  Case/Package: 0402  [RES0402]  (hidden comment: RMCF0402FT10K0)
R3007  value 10kR  Tolerance: 1%  Case/Package: 0402  [RES0402]  (hidden comment: RMCF0402FT10K0)
R3008  value 10kR  [RES0402]  (hidden comment: RMCF0402FT10K0)
R3009  value 10kR  Tolerance: 1%  Case/Package: 0402  [RES0402]  (hidden comment: RMCF0402FT10K0)
R3010  value 10kR  Tolerance: 1%  Case/Package: 0402  [RES0402]  (hidden comment: RMCF0402FT10K0)
SW3000  FSM2JSMA  [TE_FSM2JSMASTR_R]
U3000  S32K388HHT0MJBSR  [BGA289C80P17X17_1400X1400X152]  (parts A,B of 9)
U3001  LSF0102DQER  [8-XFDFN]
U3002  MC74VHC1GT08DFT1G  [SOT95P280X145-5N]
Y3000  ABS07AIG-32.768KHZ-9-1-T  [CRYSTAL3215]

### Ports
ETH_INT (in, see 11- Ethernet MAC[2B]), ETH_RGMII_RXCLK (out, see 11- Ethernet MAC[2A]), ETH_RGMII_RXD2 (in, see 11- Ethernet MAC[2A]), ETH_RGMII_RXD3 (in, see 11- Ethernet MAC[2A]), MCU_CAN0_RX (in, see 09- CAN[1A]), MCU_CAN0_TX (out, see 09- CAN[1A]), MCU_ESP_BOOT (out, see 12- BLE and FLASH[6B]), MCU_ESP_RESET (out, see 12- BLE and FLASH[2A]), MCU_ETH_SW_RESET (in, see 08- MCU PORTE_F_G[2D]), MCU_ETHERCAT_INT (in, see 13- EtherCAT[2B]), MCU_PTA8_WAKE1 (out, see 03- Power Supply[2B]), MCU_RGMII1_MDC (out, see 13- EtherCAT[2B]), MCU_RGMII1_MDIO (bidir, see 13- EtherCAT[2B]), MCU_RGMII_TXCTL (out, see 11- Ethernet MAC[2A]), MCU_RGMII_TXD0 (out, see 11- Ethernet MAC[2A]), MCU_RGMII_TXD2 (out, see 11- Ethernet MAC[2A]), MCU_RGMII_TXD3 (out, see 11- Ethernet MAC[2A]), MCU_RS485_0_RX (in, see 10- RS485[1A]), MCU_RS485_0_TX (out, see 10- RS485[1A]), MCU_RS485_1_RX (out, see 10- RS485[1B]), MCU_RS485_1_TX (in, see 10- RS485[1B]), MCU_RS485_7_RX (in, see 10- RS485[4C]), MCU_RS485_7_TX (out, see 10- RS485[4C]), MCU_UART4_RX (in, see 12- BLE and FLASH[2D]), MCU_UART4_TX (out, see 12- BLE and FLASH[2C]), MCU_UART9_RX (in, see 12- BLE and FLASH[4C]), MCU_UART9_TX (out, see 12- BLE and FLASH[4C]), RESET_ETH_SW (out, see 11- Ethernet MAC[2B]), RESET_MCU (out, see 03- Power Supply[1C], 03- Power Supply[2B], 13- EtherCAT[2C]), TCK/SWCLK (bidir, see 07-MCU PORTC_D[1A]), TDI (bidir, see 07-MCU PORTC_D[1A])

### Nets
GND: C3000.2 C3001.2 C3002.2 C3030.2 C3031.2 C3032.2 CN3000.3 CN3000.5 CN3000.7 CN3000.9 R3004.1 SW3000.3 SW3000.4 U3001.1(GND) U3002.3(GND)
VDD_HV_A: C3030.1 CN3000.1 R3000.2 R3001.2 R3002.2 R3003.2 R3006.2 R3007.2 R3008.2 U3001.2(VREF_A)
VDD_HV_B: C3031.1 C3032.1 R3005.2 R3009.2 R3010.2 U3001.7(VREF_B) U3002.5(VCC)
ESP_BOOT0: U3000.U1(PTB21/GPIO[53]/EMIOS_1_CH[17]_Y/FXIO_D4/EMIOS_2_CH[17]_Y/TRGMUX_OUT12/LPUART14_RX/EIRQ[8]/WKPU[39]) ; port MCU_ESP_BOOT
MCU_OSC32_IN: C3000.1 U3000.G1(PTA24/GPI[24]/EMIOS_1_CH[7]_H/FXIO_D3/OSC32K_XTAL) Y3000.2(OSC2)
MCU_OSC32_OUT: C3001.1 U3000.H1(PTA25/GPI[25]/EMIOS_1_CH[8]_X/EMIOS_2_CH[8]_X/FXIO_D2/EIRQ[5]/WKPU[34]/OSC32K_EXTAL) Y3000.1(OSC1)
RESET_ESP: U3000.U2(PTB5/GPIO[37]/GMAC0_MII_RMII_TXD[0]/EMIOS_0_CH[5]_G/LPSPI0_PCS1/LPSPI0_PCS0/CLKOUT_RUN/EMIOS_1_CH[11]_H/GMAC0_MII_RMII_RGMII_MDC/EIRQ[13]/TRGMUX_IN0) ; port MCU_ESP_RESET
RESET_MCU: C3002.1 CN3000.10 R3003.1 R3006.1 SW3000.1 SW3000.2 U3000.A3(PTA5/GPIO[5]/RESET_B/EIRQ[5]) U3001.3(A1) ; port RESET_MCU
TCK/SWCLK: CN3000.4 R3004.2 ; port TCK/SWCLK
TDI: CN3000.8 R3002.1 ; port TDI
TDO: CN3000.6 R3001.1 U3000.G8(PTA10/GPIO[10]/EMIOS_0_CH[12]_H/FXIO_D0/JTAG_TDO/TRACENOETM_SWO/EIRQ[18])
TMS/SWIO: CN3000.2 R3000.1 U3000.F6(PTA4/GPIO[4]/FXIO_D6/CMP0_OUT/JTAG_TMS/SWD_DIO/EIRQ[4]/ADC1_S15)
NetCN7002_4: U3000.D15(PTB10/GPIO[42]/LPSPI4_SCK/EMIOS_1_CH[17]_Y/LPUART0_DTR_B/LPUART9_TX/LCU0_OUT9/FXIO_D27/EIRQ[24]/ADC0_X[2]/CMP2_IN1) ; port MCU_UART9_TX
NetCN7002_5: U3000.C15(PTB9/GPIO[41]/LPSPI4_SOUT/EMIOS_1_CH[16]_X/LCU0_OUT10/FXIO_D28/LPUART1_RIN_B/LPUART9_RX/EIRQ[15]/ADC0_X[1]/WKPU[17]/CMP2_IN2) ; port MCU_UART9_RX
NetR1008_1: U3000.A2(PTA8/GPIO[8]/EMIOS_1_CH[12]_H/LPSPI2_SOUT/FXIO_D6/EMIOS_2_CH[7]_H/EXTWAKE/LPUART2_RX/EIRQ[16]/ADC0_P2/WKPU[23]) ; port MCU_PTA8_WAKE1
NetR3005_1: R3005.1 U3002.4(Y) ; port RESET_ETH_SW
NetR3007_1: R3007.1 U3001.4(A2) ; port MCU_ETH_SW_RESET
NetR3008_1: R3008.1 U3001.8(EN)
NetR3009_1: R3009.1 U3001.5(B2) U3002.1(B)
NetR3010_1: R3010.1 U3001.6(B1) U3002.2(A)
NetR6000_1: U3000.M6(PTB22/GPIO[54]/CAN1_TX/EMIOS_1_CH[18]_Y/LPSPI3_PCS1/EMIOS_2_CH[18]_Y/LPUART1_TX/FXIO_D15/TRGMUX_OUT13/GMAC0_MII_RMII_TX_CLK/GMAC0_MII_CRS/GMAC0_MII_RMII_RX_DV_RGMII_RXCTL/GMAC0_MII_RGMII_RX_CLK/EIRQ[9]) ; port ETH_RGMII_RXCLK
NetR6002_1: U3000.P7(PTB24/GPIO[56]/ADC1_MA[1]/EMIOS_1_CH[20]_Y/FXIO_D5/EMIOS_2_CH[20]_Y/GMAC0_MII_RGMII_RXD3/GMAC0_MII_RMII_RGMII_RXD[1]/GMAC0_MII_RGMII_RXD2/EIRQ[11]) ; port ETH_RGMII_RXD3
NetR6003_1: U3000.M7(PTB23/GPIO[55]/ADC1_MA[0]/EMIOS_1_CH[19]_Y/FXIO_D4/EMIOS_2_CH[19]_Y/TRGMUX_OUT14/GMAC0_MII_RGMII_RXD2/CAN1_RX/GMAC0_MII_COL/GMAC0_MII_RMII_RGMII_RXD[0]/GMAC0_MII_RMII_RGMII_RXD[1]/LPUART1_RX/EIRQ[10]/WKPU[40]) ; port ETH_RGMII_RXD2
NetR6007_1: U3000.P8(PTB25/GPIO[57]/LPUART15_TX/EMIOS_1_CH[21]_Y/FXIO_D6/EMIOS_2_CH[21]_Y/LPSPI2_PCS0/GMAC0_RGMII_TXCTL/EIRQ[12]) ; port MCU_RGMII_TXCTL
NetR6008_1: U3000.U10(PTB3/GPIO[35]/LPUART9_TX/EMIOS_0_CH[9]_H/LPSPI2_SOUT/ADC0_MA[0]/CAN4_TX/LCU1_OUT2/FXIO_D17/GMAC0_MII_RGMII_TXD3/GMAC0_MII_RMII_RGMII_TX_CLK/SAI0_MCLK/EIRQ[11]/TRGMUX_IN2) ; port MCU_RGMII_TXD3
NetR6009_1: U3000.P10(PTB28/GPIO[60]/ADC1_MA[2]/GMAC0_MII_RGMII_TXD2/FXIO_D9/EMIOS_2_CH[10]_H/LPSPI2_SIN/LCU1_OUT11/GMAC0_PPS3/GMAC0_MII_RGMII_TXD3/LPUART5_RX/EIRQ[14]/WKPU[42]) ; port MCU_RGMII_TXD2
NetR6011_1: U3000.U12(PTB29/GPIO[61]/LPUART6_TX/GMAC0_MII_RMII_RGMII_TXD[0]/FXIO_D10/EMIOS_2_CH[11]_H/LPSPI2_SCK/LCU1_OUT10/SAI0_D1/GMAC0_MII_RMII_RGMII_TXD[1]/GMAC0_MII_RGMII_TXD2/CAN4_RX) ; port MCU_RGMII_TXD0
NetR6019_1: U3000.U3(PTB4/GPIO[36]/GMAC0_MII_RMII_TXD[1]/EMIOS_0_CH[4]_G/LPSPI0_SOUT/GMAC0_MII_RMII_RGMII_MDIO/EMIOS_1_CH[10]_H/SAI0_D1/EIRQ[12]/TRGMUX_IN1) ; port ETH_INT
NetR8013_1: U3000.R9(PTB26/GPIO[58]/EMIOS_1_CH[22]_X/FXIO_D7/EMIOS_2_CH[22]_X/GMAC0_MII_RX_CLK/LPUART15_RX/EIRQ[13]/WKPU[41]) ; port MCU_ETHERCAT_INT
NetR8014_1: U3000.N2(PTA28/GPIO[28]/EMIOS_1_CH[11]_H/LPSPI1_SCK/EMIOS_2_CH[11]_H/GMAC1_MII_RMII_RGMII_MDC/CAN0_RX/LPUART0_RX/EIRQ[6]) ; port MCU_RGMII1_MDC
NetR8015_1: U3000.M3(PTA29/GPIO[29]/EMIOS_1_CH[12]_H/GMAC0_PPS2/LPUART2_TX/LPSPI1_SIN/EMIOS_2_CH[12]_H/GMAC1_MII_RMII_RGMII_MDIO) ; port MCU_RGMII1_MDIO
NetU3000_B1: U3000.B1(PTA18/GPIO[18]/EMIOS_1_CH[0]_X/LPUART1_TX/LPSPI1_SOUT/EMIOS_1_CH[16]_X/EMIOS_2_CH[0]_X/EIRQ[0]/TRGMUX_IN12/ADC2_P0) ; port MCU_RS485_1_TX
NetU3000_C1: U3000.C1(PTA19/GPIO[19]/EMIOS_1_CH[1]_H/LPSPI1_SCK/EMIOS_2_CH[1]_H/LPUART1_RX/EIRQ[1]/TRGMUX_IN13/ADC2_P1) ; port MCU_RS485_1_RX
NetU3000_J16: U3000.J16(PTB15/GPIO[47]/EMIOS_0_CH[3]_G/LPSPI1_SIN/LPUART7_TX/FXIO_D22/EXTWAKE/EIRQ[29]/WKPU[33]/ADC1_S11) ; port MCU_RS485_7_TX
NetU3000_J17: U3000.J17(PTB14/GPIO[46]/EMIOS_0_CH[2]_G/LPSPI1_SCK/LCU0_OUT7/FXIO_D23/LPUART7_RX/EIRQ[28]/ADC1_S9/ADC2_S9/ADC0_S9) ; port MCU_RS485_7_RX
NetU3000_K16: U3000.K16(PTB17/GPIO[49]/EMIOS_0_CH[5]_G/LPSPI1_PCS3/EMIOS_1_CH[7]_H/LPSPI3_PCS0/FXIO_D20/LPUART4_RX/EIRQ[31]/WKPU[14]/ADC1_X[2]) ; port MCU_UART4_RX
NetU3000_K17: U3000.K17(PTB16/GPIO[48]/EMIOS_0_CH[4]_G/LPSPI1_SOUT/LPUART4_TX/FXIO_D21/PGOOD/EIRQ[30]/ADC1_S12/WKPU[13]) ; port MCU_UART4_TX
NetU3000_M15: U3000.M15(PTA6/GPIO[6]/LPSPI1_PCS1/EMIOS_1_CH[13]_H/FXIO_D19/LPSPI3_PCS1/CAN0_RX/LPUART0_RIN_B/LPUART1_CTS/LPUART3_RX/EIRQ[6]/ADC0_S18/WKPU[15]) ; port MCU_CAN0_RX
NetU3000_M16: U3000.M16(PTA7/GPIO[7]/LPUART3_TX/LPSPI0_PCS1/EMIOS_1_CH[11]_H/CAN0_TX/LPUART1_RTS/FXIO_D9/LPUART0_DCD_B/EIRQ[7]/ADC0_S11) ; port MCU_CAN0_TX
NetU3000_P16: U3000.P16(PTB0/GPIO[32]/LPI2C0_SDAS/FXIO_D14/LPSPI0_PCS0/EMIOS_0_CH[3]_G/LCU1_OUT5/EMIOS_1_CH[6]_H/HSE_TAMPER_LOOP_OUT0_/CAN0_RX/LPUART0_RX/EIRQ[8]/ADC0_S14/WKPU[7]/ADC1_S14) ; port MCU_RS485_0_RX
NetU3000_R17: U3000.R17(PTB1/GPIO[33]/LPI2C0_SCLS/LPUART0_TX/LPSPI0_SOUT/EMIOS_0_CH[7]_G/CAN0_TX/EMIOS_1_CH[5]_H/LCU1_OUT4/HSE_TAMPER_EXTIN0/EIRQ[9]/ADC0_S15/ADC1_S15) ; port MCU_RS485_0_TX

Not connected (* = marked no-connect by the designer): U3000 A7(PTA12/GPIO[12]/LPSPI1_PCS5/EMIOS_0_CH[14]_H/CLKOUT_STANDBY/FXIO_D9/EMIOS_1_CH[2]_H/CMP1_OUT/CAN1_RX/LPUART11_RX/EIRQ[20]/ADC1_P0) A9(PTA13/GPIO[13]/LPSPI1_PCS4/EMIOS_0_CH[15]_H/FXIO_D8/EMIOS_1_CH[3]_H/LPUART11_TX/EIRQ[21]/ADC1_P1/WKPU[4]) A10(PTA14/GPIO[14]/EMIOS_1_CH[4]_H/LPSPI1_PCS3/EMIOS_2_CH[18]_Y/FXIO_D14/LPSPI5_PCS1/EIRQ[22]/ADC1_P4) A11(PTA15/GPIO[15]/EMIOS_0_CH[10]_H/LPSPI0_PCS3/LPSPI2_PCS3/LPUART1_DTR_B/LPSPI5_PCS0/FXIO_D31/LPUART6_RX/EIRQ[23]/WKPU[20]/ADC1_P7) A12(PTA16/GPIO[16]/LPSPI4_PCS3/EMIOS_0_CH[11]_H/LPSPI1_PCS2/LPSPI0_PCS4/LPUART6_TX/FXIO_D30/LPUART1_DSR_B/EIRQ[4]/WKPU[31]/ADC1_S13) A13(PTA0/GPIO[0]/LPSPI4_PCS2/EMIOS_0_CH[17]_Y/LCU0_OUT4/FXIO_D2/EMIOS_1_CH[0]_X/LPSPI0_PCS7/TRGMUX_OUT3/LPUART0_CTS/EIRQ[0]/CMP1_IN0/ADC0_S8) A14(PTB8/GPIO[40]/LPSPI4_PCS0/EMIOS_1_CH[15]_H/LCU0_OUT11/LPSPI0_PCS5/FXIO_D29/LPUART1_DCD_B/EIRQ[14]/ADC0_X[0]/WKPU[25]/CMP2_IN3) B3(PTA9/GPIO[9]/LPUART2_TX/LPSPI2_PCS0/FXIO_D7/LPSPI3_PCS0/CMP2_OUT/PGOOD/EIRQ[17]/ADC0_P7/WKPU[21]) B7(PTA11/GPIO[11]/CAN1_TX/EMIOS_0_CH[13]_H/EMIOS_1_CH[1]_H/FXIO_D1/CMP0_RRT/LPSPI1_PCS0/LPSPI2_SCK/EIRQ[19]/ADC1_S10) B14(PTA1/GPIO[1]/LPSPI4_PCS1/EMIOS_0_CH[9]_H/LPUART0_RTS/FXIO_D3/LCU0_OUT5/LPSPI0_PCS6/TRGMUX_OUT0/EIRQ[1]/CMP1_IN1/WKPU[5]/ADC0_S9) C3(PTA22/GPIO[22]/EMIOS_1_CH[4]_H/FXIO_D1/LPSPI1_PCS1/CAN1_RX) C17(PTB11/GPIO[43]/LPSPI4_SIN/EMIOS_1_CH[18]_Y/LCU0_OUT8/FXIO_D26/LPI2C0_HREQ/LPUART0_DSR_B/EIRQ[25]/ADC0_X[3]/WKPU[16]/CMP2_IN0) D1(PTA21/GPIO[21]/LPSPI2_PCS2/EMIOS_1_CH[3]_H/FXIO_D0/LPSPI1_PCS0/EMIOS_2_CH[3]_H/EIRQ[3]/TRGMUX_IN15/ADC2_S12) D3(PTA23/GPIO[23]/CAN1_TX/EMIOS_1_CH[6]_H/FXIO_D2/ADC1_S19) D17(PTA2/GPIO[2]/FCCU_ERR0/EMIOS_1_CH[19]_Y/FXIO_D4/LCU0_OUT3/LPSPI5_SIN/FCCU_ERR_IN0/LPSPI1_SIN/LPUART0_RX/EIRQ[2]/WKPU[0]/CMP1_IN2/ADC1_X[0]) E4(PTA20/GPIO[20]/EMIOS_1_CH[2]_H/LPSPI1_SIN/EMIOS_2_CH[2]_H/EIRQ[2]/TRGMUX_IN14/WKPU[59]/ADC2_P2) E16(PTA3/GPIO[3]/FCCU_ERR1/EMIOS_1_CH[20]_Y/LPSPI1_SCK/LCU0_OUT2/FXIO_D5/LPUART0_TX/LPSPI5_SCK/FCCU_ERR_IN1/EIRQ[3]/ADC1_S17) H16(PTB13/GPIO[45]/LPSPI3_PCS2/EMIOS_0_CH[1]_G/FXIO_D8/LCU0_OUT3/LPUART8_TX/FXIO_D24/LPUART0_RIN_B/EIRQ[27]/ADC1_S8/ADC2_S8/WKPU[11]/ADC0_S8) H17(PTB12/GPIO[44]/LPSPI3_PCS3/EMIOS_0_CH[0]_X/LCU0_OUT2/FXIO_D25/LPUART0_DCD_B/LPUART8_RX/EIRQ[26]/WKPU[12]/ADC1_X[1]) L2(PTA26/GPIO[26]/EMIOS_1_CH[9]_H/LPSPI1_PCS0/LPSPI0_PCS0/FXIO_D1/EMIOS_2_CH[9]_H/GMAC0_PPS0/WKPU[35]) L17(PTA17/GPIO[17]/EMIOS_0_CH[6]_G/LPUART4_TX/LPSPI3_SOUT/FXIO_D19/ADC2_S19) M2(PTA27/GPIO[27]/FXIO_D5/EMIOS_1_CH[10]_H/GMAC0_PPS1/LPUART0_TX/CAN0_TX/EMIOS_2_CH[10]_H) P1(PTA31/GPIO[31]/GMAC0_PPS0/EMIOS_1_CH[14]_H/FXIO_D0/LPSPI0_PCS1/TRGMUX_OUT8/GMAC1_PPS0/GMAC1_MII_CRS/SAI0_MCLK) P3(PTA30/GPIO[30]/EMIOS_1_CH[13]_H/LPSPI1_SOUT/LPSPI0_SOUT/EMIOS_2_CH[13]_H/GMAC1_MII_RMII_RGMII_MDC/LPUART2_RX/EIRQ[7]/WKPU[37]) P9(PTB27/GPIO[59]/LPUART5_TX/EMIOS_1_CH[23]_X/FXIO_D8/EMIOS_2_CH[23]_X/LPSPI2_SOUT/SAI0_D0/GMAC1_MII_RMII_RX_ER) R1(PTB18/GPIO[50]/LPUART13_TX/EMIOS_1_CH[15]_H/FXIO_D1/LPSPI1_PCS1/EMIOS_2_CH[14]_H/TRGMUX_OUT9/GMAC0_MII_RMII_RX_DV_RGMII_RXCTL) R2(PTB19/GPIO[51]/GMAC0_PPS0/EMIOS_1_CH[15]_H/FXIO_D2/GMAC0_MII_RMII_TX_EN/EMIOS_2_CH[15]_H/TRGMUX_OUT10/GMAC1_MII_RMII_RGMII_MDIO/LPUART13_RX/WKPU[38]) T1(PTB20/GPIO[52]/LPUART14_TX/EMIOS_1_CH[16]_X/FXIO_D3/EMIOS_2_CH[16]_X/TRGMUX_OUT11/GMAC1_PPS2) T11(PTB2/GPIO[34]/ADC1_MA[0]/EMIOS_0_CH[8]_X/LPSPI2_SIN/LCU1_OUT3/SAI0_D0/FXIO_D18/CAN4_RX/LPUART9_RX/EIRQ[10]/TRGMUX_IN3/WKPU[8]) T14(PTB31/GPIO[63]/EMIOS_0_CH[19]_Y/HSE_TAMPER_EXTIN0/EIRQ[15]) U13(PTB30/GPIO[62]/FXIO_D11/HSE_TAMPER_LOOP_OUT0)

### Notes on the sheet
- TITLE:
- PROJECT:
- Design by:
- Check by:
- Approve by:
- DRAWING NUMBER:
- REVISION:
- SIZE: A3
- SHEET NUMBER
- OFF
- DATE:
- (in symbol CMP-ROOT-0128-12) 1,2; 3,4

### Library data of the parts
C3000 C3001 = CMP-00203-1: CAP CER 12PF 50V C0G/NP0 0402; Manufacturer 1: Murata Electronics; Dielectric: C0G; Crossable(YES/NO): YES; Mount Type(SMD/TH): SMD; Tolerance: 5%; Mount: Surface Mount; Lead Free: Lead Free; Weight: 0.000212oz; Ratings: AEC-Q200; Termination: SMD/SMT; Packaging: Tape and Reel; Max Operating Temperature: 125°C; Case Code (Imperial): 0402; Height: 0.5mm; Voltage Rating (DC): 50V; Manufacturer Part Number 1: GCM1555C1H120JA16D; Thickness: 0.022inch; Width: 0.02inch; Case Code (Metric): 1005; Min Operating Temperature: -55°C; Length: 0.039inch; Package Quantity: 10000
C3002 C3030-C3032 = CMP-00988-1: CAP CER 0.1UF 16V X7R 0402; Manufacturer 1: KYOCERA AVX; Crossable(YES/NO): YES; Mount Type(SMD/TH): SMD; Case Code (Imperial): 0402; Case Code (Metric): 1005; Dielectric: X7R; Manufacturer Part Number 1: 0402YC104KAT2A; Max Operating Temperature: 125°C; Min Operating Temperature: -55°C; Mount: Surface Mount; Voltage Rating: 16V
CN3000 = CMP-ROOT-0060-2: CONN HEADER SMD 10POS 1.27MM; Manufacturer 1: Samtec Inc.; Current Rating: 1.75A; Number of Positions: 10; Connector Type: Male Pin; Crossable(YES/NO): NO; Row Spacing: 0.05inch; Gender: Male; Termination: Solder; Color: Black; Contact Mating Length: 0.12inch; Housing Color: Black; Max Current Rating: 1.75A; Housing Material: Polymer; Mount Type(SMD/TH): SMD; Orientation: Straight; Lead Free: Lead Free; Radiation Hardening: No; Contact Plating: Gold; Contact Material: Bronze; Max Operating Temperature: 125°C; Min Operating Temperature: -55°C; Packaging: Tape and Reel; Mount: Surface Mount; Depth: 3.43mm; Package Quantity: 550; REACH SVHC: No SVHC; Number of Rows: 2; Pitch: 1.27mm; Number of Contacts: 10; Length: 6.35mm; Supplier 1: Digi-Key; Manufacturer Part Number 1: FTSH-105-01-L-DV-K-TR; Stock 1: 11254; Pricing 1: 1=3.60000, 10=3.45800, 100=2.88200 (USD); RoHS: Yes; ComponentLink1URL: https://datasheet.ciiva.com/10245/ftsh-mt-10245289.pdf?src-supplier=Avnet; ComponentLink1Description: https://datasheet.ciiva.com/10245/ftsh-mt-10245289.pdf?src-supplier=Avnet; ComponentLink2URL: https://datasheet.ciiva.com/739/ftsh-1xx-xx-xxx-dv-xxx-mkt-739005.pdf?src-supplier=Digi-Key; ComponentLink2Description: https://datasheet.ciiva.com/739/ftsh-1xx-xx-xxx-dv-xxx-mkt-739005.pdf?src-supplier=Digi-Key; ComponentLink3URL: https://datasheet.ciiva.com/23735/81359-23735917.pdf?src-supplier=Newark; ComponentLink3Description: https://datasheet.ciiva.com/23735/81359-23735917.pdf?src-supplier=Newark; Supplier Part Number 1: SAM13165CT-ND
R3000-R3010 = CMP-01105-1: RES 10K OHM 1% 1/16W 0402; Manufacturer: Stackpole Electronics; Package Length: 1mm; Package Height: 0.3mm; Package Width: 0.5mm; Power: 63mW; Rated Temperature: 70°C; Reference Standard: AEC-Q200; Temperature Coefficient (ppm/Cel): 100; Working Voltage: 50V; Category: Chip SMD Resistors; Construction: Rectangular; JESD-609 Code: e3; Manufacturer Part Number: RMCF0402FT10K0; Max Operating Temperature: 155°C; Min Operating Temperature: -55°C; Mounting Technology: Surface Mount; Pins: 2; Package Shape: Rectangular; Packaging: Tape and Reel; Reach SVHC Compliant: Yes; Resistor Type: FIXED RESISTOR; RoHS Compliant: Yes; Technology: METAL GLAZE/THICK FILM; Terminal Finish: Nickel; Termination: Wraparound
  R3008: Tolerance: 1%; Case/Package: 0402
SW3000 = CMP-ROOT-0128-12: SWITCH TACTILE SPST-NO 0.05A 24V; Manufacturer 1: TE Connectivity; Throw Configuration: SPST; Contact Current Rating: 50mA; Crossable(YES/NO): NO; Max Voltage Rating (DC): 12V; Actuator Material: Polyamide; Switch Function: Off-Mom; Mount Type(SMD/TH): SMD; Operating Force: 1.57N; Actuator Length: 0.7mm; Switch Travel: 0.25mm; Contact Resistance: 100mR; Illumination Type: Non-Illuminated,Illuminated; Actuator Type: Standard; Mechanical Life: 100000Cycles; Contact Material: Copper Alloy; Max Operating Temperature: 85°C; Orientation: Straight; Mount: Surface Mount; Type: Switch; Package Quantity: 750; Min Operating Temperature: -35°C; Manufacturer Part Number 1: FSM2JSMA; Packaging: Loose Piece; Voltage Rating: 24V; Width: 6mm; Voltage Rating (DC): 24V; Termination: Gull Wing; Case/Package: SMA (6mm x 10mm); Contact Plating: Silver; Length: 6mm; Electrical Life: 100000Cycles; Current Rating: 50mA; REACH SVHC: Unknown
U3000 = CMP-01150-1: ARM® Cortex®-M7F S32K3 Microcontroller IC 32-Bit 5-Core 320MHz 8MB (8M x 8) FLASH 289-LFBGA (14x14); Manufacturer: NXP Semiconductors; Category: Microcontrollers; Manufacturer Part Number: S32K388HHT0MJBSR
U3001 = CMP-01193-1: IC VOLTAGE LEVEL BIDIR 8-X2SON; Manufacturer: Texas Instruments; Manufacturer Lifecycle Status: ACTIVE; Channel Type: Bidirectional; Data Rate: 200Mbps; High Level Output Current: 64mA; Logic Function: Translator; Max Junction Temperature (Tj): 150°C; Max Supply Voltage: 5.5V; Min Supply Voltage: 950mV; Number of Bits: 1; Propagation Delay: 1.3ns; Turn-On Delay Time: 1.5ns; Min Operating Temperature: -40°C; Ambient Temperature Range High: 125°C; Category: Voltage Level Shifters; Height: 400µm; Lead Free: Lead Free; Length: 1.4mm; Lifecycle Status: Production; Low Level Output Current: 64mA; Manufacturer Part Number: LSF0102DQER; Max Operating Temperature: 125°C; Mounting Technology: Surface Mount; Number of Circuits: 1; Number of Inputs: 1; Number of Outputs: 1; Pins: 8; Packaging: Digi-Reel®; Radiation Hardening: No; RoHS: Compliant; Schedule B: 8542390000, 8542390000|8542390000|8542390000|8542390000|8542390000; Thickness: 370µm; Width: 1mm
U3002 = CMP-01194-1: IC GATE AND 1CH 2-INP SC88A; Manufacturer: onsemi; Manufacturer Lifecycle Status: ACTIVE; Number of Outputs: 1; Max Supply Voltage: 5.5V; Min Supply Voltage: 3V; Number of Inputs: 2; Operating Supply Voltage: 3.3V; Propagation Delay: 16.5ns; Category: Logic Gates; China RoHS: Compliant; Height - Seated (Max): 1.1mm; Length: 2mm; Lifecycle Status: Production; Manufacturer Part Number: MC74VHC1GT08DFT1G; Max Operating Temperature: 125°C; Min Operating Temperature: -55°C; Number of Channels: 1; Number of Circuits: 1; Number of Terminals: 5; REACH SVHC: Yes; RoHS: Compliant; Terminal Pitch: 650µm; Width: 1.25mm
Y3000 = CMP-00382-1: CRYSTAL 32.768KHZ 9PF SMD; Manufacturer 1: Abracon LLC; ESR (Equivalent Series Resistance): 70kR; Frequency Tolerance: 10ppm; Crossable(YES/NO): NO; Width: 0.059inch; Ratings: AEC-Q200; Min Operating Temperature: -40°C; Manufacturer Part Number 1: ABS07AIG-32.768KHZ-9-1-T; Number of Pins: 2; Mount Type(SMD/TH): SMD; Length: 0.126inch; Mount: Surface Mount; Height: 0.035inch; Packaging: Tape and Reel; Frequency: 32.768kHz; Case/Package: SMD/SMT; Load Capacitance: 9pF; Max Operating Temperature: 125°C